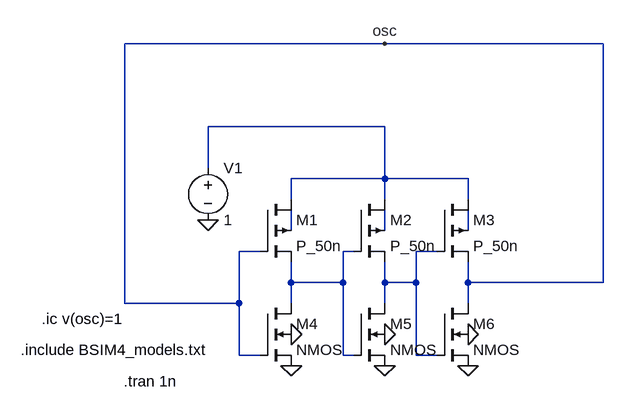
[diagram p0: schematic exp_10_electro.asc]
exp_10_electro.asc, the LTspice schematic file:
Version 4
SHEET 1 880 680
WIRE 176 -192 -224 -192
WIRE 512 -192 176 -192
WIRE 176 -64 -96 -64
WIRE -96 0 -96 -64
WIRE 176 16 176 -64
WIRE 176 16 32 16
WIRE 304 16 176 16
WIRE 32 48 32 16
WIRE 176 48 176 16
WIRE 304 48 304 16
WIRE 32 96 32 64
WIRE 176 96 176 64
WIRE 304 96 304 64
WIRE -16 128 -48 128
WIRE 128 128 112 128
WIRE 256 128 224 128
WIRE 32 176 32 144
WIRE 112 176 112 128
WIRE 112 176 32 176
WIRE 176 176 176 144
WIRE 224 176 224 128
WIRE 224 176 176 176
WIRE 304 176 304 144
WIRE 512 176 512 -192
WIRE 512 176 304 176
WIRE -224 208 -224 -192
WIRE -48 208 -48 128
WIRE -48 208 -224 208
WIRE 32 208 32 176
WIRE 176 208 176 176
WIRE 304 208 304 176
WIRE -48 288 -48 208
WIRE -16 288 -48 288
WIRE 112 288 112 176
WIRE 128 288 112 288
WIRE 224 288 224 176
WIRE 256 288 224 288
FLAG -96 80 0
FLAG 32 256 0
FLAG 32 304 0
FLAG 304 304 0
FLAG 176 304 0
FLAG 304 256 0
FLAG 176 256 0
FLAG 176 -192 osc
SYMBOL pmos4 -16 48 R0
SYMATTR InstName M1
SYMATTR Value P_50n
SYMATTR Value2 l=50n w=500n
SYMBOL nmos4 -16 208 R0
SYMATTR InstName M4
SYMATTR Value2 l=50n w=500n
SYMBOL voltage -96 -16 R0
WINDOW 123 0 0 Left 0
WINDOW 39 0 0 Left 0
SYMATTR InstName V1
SYMATTR Value 1
SYMBOL pmos4 128 48 R0
SYMATTR InstName M2
SYMATTR Value P_50n
SYMATTR Value2 l=50n w=500n
SYMBOL pmos4 256 48 R0
SYMATTR InstName M3
SYMATTR Value P_50n
SYMATTR Value2 l=50n w=500n
SYMBOL nmos4 128 208 R0
SYMATTR InstName M5
SYMATTR Value2 l=50n w=500n
SYMBOL nmos4 256 208 R0
SYMATTR InstName M6
SYMATTR Value2 l=50n w=500n
TEXT -226 328 Left 2 !.tran 1n
TEXT -384 280 Left 2 !.include BSIM4_models.txt
TEXT -352 232 Left 2 !.ic v(osc)=1

The netlist it stands for:
* exp_10_electro.asc
M1 N001 osc N005 N002 P_50n l=50n w=500n
M4 N005 osc 0 0 NMOS l=50n w=500n
V1 N001 0 1
M2 N001 N005 N006 N003 P_50n l=50n w=500n
M3 N001 N006 osc N004 P_50n l=50n w=500n
M5 N006 N005 0 0 NMOS l=50n w=500n
M6 osc N006 0 0 NMOS l=50n w=500n
.model NMOS NMOS
.model PMOS PMOS
.lib standard.mos
.tran 1n
.include BSIM4_models.txt
.ic v(osc)=1
.backanno
.end